# Altium schematic sheet debug.SchDoc
size A4
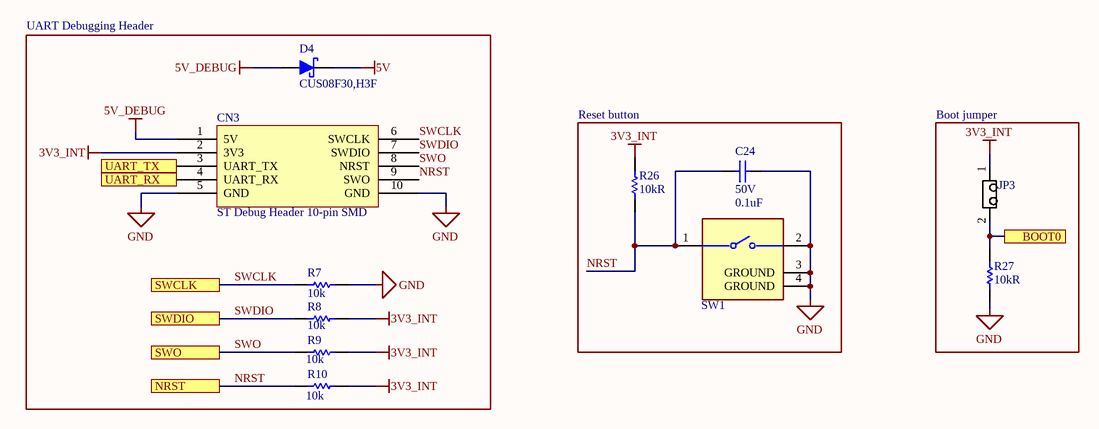
[diagram p0: debug.SchDoc]

## Parts
C24  Voltage: 50V  Capacitance: 0.1uF  [FP-CL10-0_1-MFG]  (hidden comment: CL10B104JB8NNNC)
CN3  ST Debug Header 10-pin SMD  [ST Debug Header 10-pin SMD-Footprint-1]
D4  CUS08F30,H3F  [SC-76]
JP3  1x2 Male Header  [2X1 Males Header]  (value not drawn)
R7  value 10k  [RESC1608N(0603")]  (hidden comment: 10kR, 1%, 1/10W, 0603 SMD)
R8  value 10k  [RESC1608N(0603")]  (hidden comment: 10kR, 1%, 1/10W, 0603 SMD)
R9  value 10k  [RESC1608N(0603")]  (hidden comment: 10kR, 1%, 1/10W, 0603 SMD)
R10  value 10k  [RESC1608N(0603")]  (hidden comment: 10kR, 1%, 1/10W, 0603 SMD)
R26  10kR  [RESC1608N(0603")]
R27  10kR  [RESC1608N(0603")]
SW1  PTS636SKG25SMTRLFS  [FP-PTS636_SKG25_SMTR_LFS-MFG]  (value not drawn)

## Blocks framed on the sheet
UART Debugging Header: CN3 D4 R7-R10
Reset button: C24 R26 SW1
Boot jumper: JP3 R27

## Ports
BOOT0, NRST, SWCLK, SWDIO, SWO, UART_RX, UART_TX

## Nets
3V3_INT: CN3.2(3V3) JP3.1 R8.2 R9.2 R10.2 R26.1
5V: D4.K(Cathode)
5V_DEBUG: CN3.1(5V) D4.A(Anode)
GND: C24.1 CN3.5(GND) CN3.10(GND) R7.2 R27.2 SW1.2 SW1.3(GROUND) SW1.4(GROUND)
BOOT0: JP3.2 R27.1 ; port BOOT0
NRST: C24.2 CN3.9(SWO) R10.1 R26.2 SW1.1 ; port NRST
SWCLK: CN3.6(SWCLK) R7.1 ; port SWCLK
SWDIO: CN3.7(SWDIO) R8.1 ; port SWDIO
SWO: CN3.8(NRST) R9.1 ; port SWO
UART_RX: CN3.4(UART_RX) ; port UART_RX
UART_TX: CN3.3(UART_TX) ; port UART_TX

## Library data of the parts
C24 = CMP-00000-3: CAP CER 0.1UF 50V X7R 0603; Tolerance: 5%; Material: Ceramic; Case Code (Imperial): 0603; Mount: Surface Mount; Thickness: 0.035inch; Depth: 0.8mm; Packaging: Tape and Reel; Package Quantity: 1; Dielectric: X7R; Height: 0.8mm; Radiation Hardening: No; Max Operating Temperature: 125°C; Voltage Rating: 50V; Case/Package: 0603; Min Operating Temperature: -55°C; Case Code (Metric): 1608; Length: 1.6mm; Contact Plating: Tin; Width: 0.031inch
CN3 = CMP-00013-1: CONN HEADER SMD 10POS 2.54MM; Row Spacing: 0.1inch; Connector Type: Male Pin; Number of Positions: 10; Mount: Surface Mount; Package Quantity: 1; Packaging: Rail/Tube; Termination: Solder; Contact Plating: Gold; Number of Rows: 2; Lead Free: Lead Free; Pitch: 0.1inch; Color: Black
D4 = CMP-057-0000-2: Diode Schottky 30V 800mA Surface Mount USC; Peak Non-Repetitive Surge Current: 5A; Element Configuration: Single; Peak Reverse Current: 50uA; Packaging: Tape and Reel; Mount: Surface Mount; Average Rectified Current: 800mA; Case/Package: SOD; Max Reverse Voltage (DC): 30V; Min Operating Temperature: -55°C; Contact Plating: Tin,Silver; Max Repetitive Reverse Voltage (Vrrm): 30V; Number of Pins: 2; Max Operating Temperature: 125°C
JP3 = CMP-004-0001-1: Made By: Andy Bates; Source: AUVic_Schematic_Library_Connectors.SchLib; Pin Count: 2; Design Item ID: 1x2 Male Header; Component Type: Standard
R7-R10 = CMP-047-0013-1: Owned By: AUVic; Made By: Ashwin Sira; Design Item ID: 10kR, 1%, 1/10W, 0603 SMD; Pin Count: 2; Component Type: Standard; Created On: 14-05-31; Last Edited: 14-05-31; Source: AUVic_Schematic_Library_Resistors.SchLib
R26 R27 = CMP-047-0013-1: 10kR, 1%, 1/10W, 0603 SMD; Owned By: AUVic; Made By: Ashwin Sira; Value: 10k; Design Item ID: 10kR; Pin Count: 2; Component Type: Standard; Created On: 14-05-31; Last Edited: 14-05-31; Source: AUVic_Schematic_Library_Resistors.SchLib
SW1 = CMP-00104-1: PTS636 Series SPST-NO Off-Mom 250 gf Top Actuated Gull Wing SMT Tactile Switch; Voltage Rating (DC): 12V; Throw Configuration: SPST; Current Rating: 50mA; Switch Function: Off-Mom